# Altium project Mainboard1.PrjPcb
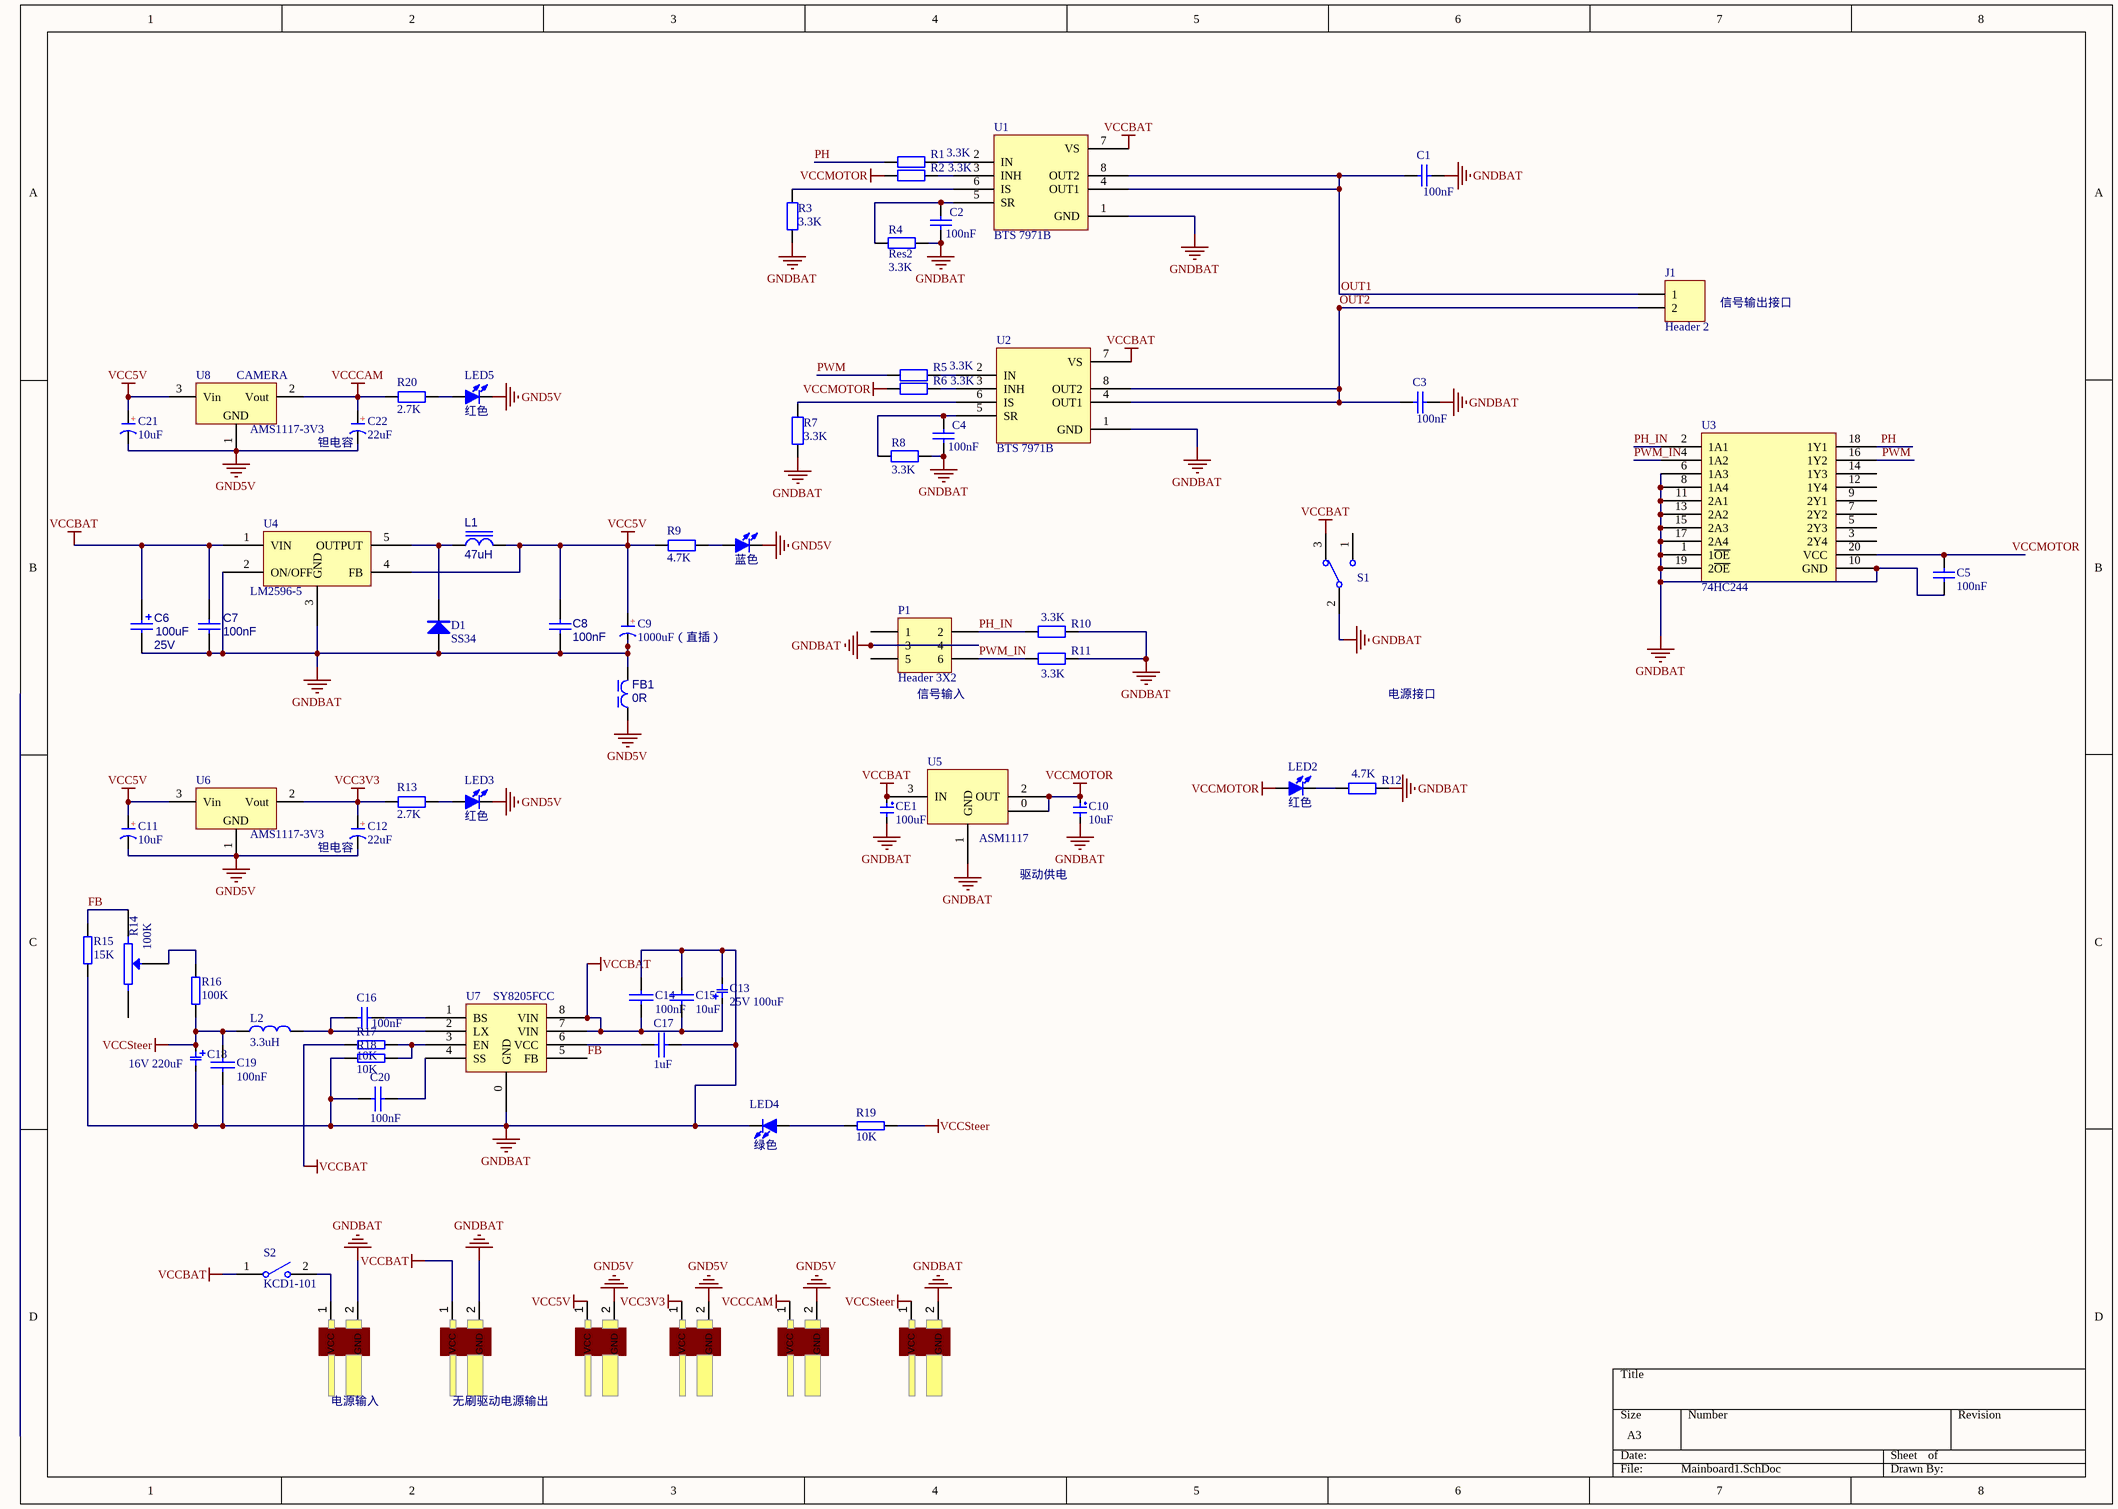
[diagram p0: Mainboard1.SchDoc]
1 sheet, 70 parts. Net scope: global (net labels, ports and power ports of the same name join across sheets).
Board files: Mainboard1.PcbDoc, logo.PcbDoc

## Sheet Mainboard1.SchDoc
size A3; DocumentNumber: 1; SheetNumber: 1; SheetTotal: 1

### Parts
C1  value 100nF  [0805]  (hidden comment: Cap)
C2  value 100nF  [0805]  (hidden comment: Cap Semi)
C3  value 100nF  [0805]  (hidden comment: Cap)
C4  value 100nF  [0805]  (hidden comment: Cap Semi)
C5  value 100nF  [0805]  (hidden comment: Cap)
C6  value 100uF  Voltage: 25V  [CAPS6.3]  (hidden comment: 100uF 25V)
C7  value 100nF  [CAPC1608[0603]S-N]  (hidden comment: 100nF ±10% 50V)
C8  value 100nF  [CAPC1608[0603]S-N]  (hidden comment: 100nF ±10% 50V)
C9  1000uF（直插）  [CAP 5.0*10*16]
C10  10uF  [CAP 5.0*10*16]
C11  10uF  [C 0805_L]
C12  22uF  [CD A(3216)]
C13  25V 100uF  [电解电容16v 220uf]
C14  100nF  [C0603]
C15  10uF  [C0603]
C16  100nF  [C0603]
C17  1uF  [C0603]
C18  16V 220uF  [电解电容16v 220uf]
C19  100nF  [C0603]
C20  100nF  [C0603]
C21  10uF  [C 0805_L]
C22  22uF  [CD A(3216)]
CE1  100uF  [CAP 5.0*10*20]
D1  SS34  [SMA[DO-214AC]]
DCIN1  T型插头  [Wired T-Header ThroughHole]  (value not drawn)
DCIN2  T型插头  [Wired T-Header ThroughHole]  (value not drawn)
DCIN3  T型插头  [Wired T-Header ThroughHole]  (value not drawn)
DCIN4  T型插头  [Wired T-Header ThroughHole]  (value not drawn)
DCIN5  T型插头  [Wired T-Header ThroughHole]  (value not drawn)
DCIN?  T型插头  [Wired T-Header ThroughHole]  (value not drawn)
FB1  0R  [INDC2012[0805]S]
J1  Header 2  [KF/WJ/DG 301-2p-5.0mm]
L1  47uH  [0630 TPC 7*7*3]
L2  3.3uH  [贴片电感7*7]
LED1  蓝色  [LED0805]
LED2  红色  [LED0805]
LED3  红色  [LED0805]
LED4  绿色  [LED0805]
LED5  红色  [LED0805]
P1  Header 3X2  [HDR2X3]
R1  value 3.3K  [0805]  (hidden comment: Res2)
R2  value 3.3K  [0805]  (hidden comment: Res2)
R3  value 3.3K  [0805]  (hidden comment: Res2)
R4  Res2  value 3.3K  [0805]
R5  value 3.3K  [0805]  (hidden comment: Res2)
R6  value 3.3K  [0805]  (hidden comment: Res2)
R7  value 3.3K  [0805]  (hidden comment: Res2)
R8  value 3.3K  [0805]
R9  4.7K  [0805]
R10  value 3.3K  [0805]  (hidden comment: Res2)
R11  value 3.3K  [0805]  (hidden comment: Res2)
R12  value 4.7K  [0805]  (hidden comment: Res2)
R13  2.7K  [0805]
R14  100K  [电位器]
R15  15K  [R0603]
R16  100K  [R0603]
R17  10K  [R0603]
R18  10K  [R0603]
R19  10K  [R0603]
R20  2.7K  [0805]
S1  SW-SPDT  [SS12D10]  (value not drawn)
S2  KCD1-101  [KCD1-101]
U1  BTS 7971B  [bts7960]
U2  BTS 7971B  [bts7960]
U3  74HC244  [SOJ-20]
U4  LM2596-5  [TO263-5A]
U5  ASM1117  [SOT223_M]
U6  AMS1117-3V3  [SOT223_M]
U7  SY8205FCC  [SOP-8E]
U8  AMS1117-3V3  [SOT223_M]

### Nets
GND5V: C11.2(K) C12.2(K) C21.2(K) C22.2(K) DCIN3.2(GND) DCIN4.2(GND) DCIN5.2(GND) FB1.1 LED1.2(K) LED3.2(K) LED5.2(K) U6.1(GND) U8.1(GND)
GNDBAT: C1.2 C2.1 C3.2 C4.1 C5.2 C6.2 C7.1 C8.1 C9.2(K) C10.2 C13.2 C14.1 C15.1 C17.2 C18.2 C19.2 C20.1 CE1.2 D1.1(A) DCIN1.2(GND) DCIN2.2(GND) DCIN?.2(GND) FB1.2 LED4.2(K) P1.3 P1.4 R3.2 R4.2 R7.2 R8.2 R10.2 R11.2 R12.2 R15.2 R18.2 S1.2 U1.1(GND) U2.1(GND) U3.1(1~{OE}) U3.6(1A3) U3.8(1A4) U3.10(GND) U3.11(2A1) U3.13(2A2) U3.15(2A3) U3.17(2A4) U3.19(2~{OE}) U4.2(ON/OFF) U4.3(GND) U5.1(GND) U7.0(GND)
VCC3V3: C12.1(A) DCIN4.1(VCC) R13.2 U6.2(Vout)
VCC5V: C8.2 C9.1(A) C11.1(A) C21.1(A) DCIN3.1(VCC) L1.2 R9.2 U4.4(FB) U6.3(Vin) U8.3(Vin)
VCCBAT: C6.1 C7.2 C13.1 C14.2 C15.2 CE1.1 DCIN2.1(VCC) R17.2 S1.3 S2.1 U1.7(VS) U2.7(VS) U4.1(VIN) U5.3(IN) U7.7(VIN) U7.8(VIN)
VCCCAM: C22.1(A) DCIN5.1(VCC) R20.2 U8.2(Vout)
VCCMOTOR: C5.1 C10.1 LED2.1(A) R2.2 R6.2 U3.20(VCC) U5.0 U5.2(OUT)
VCCSteer: C18.1 C19.1 DCIN?.1(VCC) L2.2 R16.2 R19.1
FB: R14.1 R15.1 U7.5(FB)
OUT1: C1.1 J1.1 U1.4(OUT1) U1.8(OUT2)
OUT2: C3.1 J1.2 U2.4(OUT1) U2.8(OUT2)
PH: R1.1 U3.18(1Y1)
PH_IN: P1.2 R10.1 U3.2(1A1)
PWM: R5.1 U3.16(1Y2)
PWM_IN: P1.6 R11.1 U3.4(1A2)
NetC2_2: C2.2 R4.1 U1.5(SR)
NetC4_2: C4.2 R8.1 U2.5(SR)
NetC16_1: C16.1 L2.1 U7.2(LX)
NetC16_2: C16.2 U7.1(BS)
NetC17_1: C17.1 U7.6(VCC)
NetC20_2: C20.2 U7.4(SS)
NetD1_2: D1.2(K) L1.1 U4.5(OUTPUT)
NetDCIN1_1: DCIN1.1(VCC) S2.2
NetLED1_1: LED1.1(A) R9.1
NetLED2_2: LED2.2(K) R12.1
NetLED3_1: LED3.1(A) R13.1
NetLED4_1: LED4.1(A) R19.2
NetLED5_1: LED5.1(A) R20.1
NetR1_2: R1.2 U1.2(IN)
NetR2_1: R2.1 U1.3(INH)
NetR3_1: R3.1 U1.6(IS)
NetR5_2: R5.2 U2.2(IN)
NetR6_1: R6.1 U2.3(INH)
NetR7_1: R7.1 U2.6(IS)
NetR14_3: R14.3(W) R16.1
NetR17_1: R17.1 R18.1 U7.3(EN)

Not connected (* = marked no-connect by the designer): P1 1 5; R14 2; S1 1; U3 3(2Y4) 5(2Y3) 7(2Y2) 9(2Y1) 12(1Y4) 14(1Y3)

### Notes on the sheet
- 信号输出接口
- (near U8) CAMERA
- (near C22) 钽电容
- (near P1) 信号输入
- 电源接口
- (near C12) 钽电容
- 驱动供电
- 电源输入
- 无刷驱动电源输出
- (in symbol C-CAP) +
- (in symbol C-CD) +
- (in symbol C-CM) +

### Library data of the parts
C1 C3 C5 = Cap: Capacitor; Published: 8-Jun-2000; LatestRevisionDate: 17-Jul-2002; LatestRevisionNote: Re-released for DXP Platform.; PackageReference: RAD-0.3; Publisher: Altium Limited
C2 C4 = Cap Semi: Capacitor (Semiconductor SIM Model); Published: 8-Jun-2000; LatestRevisionDate: 17-Jul-2002; LatestRevisionNote: Re-released for DXP Platform.; PackageReference: C1206; Publisher: Altium Limited
C6 = Cap-Solid: Polarized Capacitor (Radial); Published: 8-Jun-2000; Revision: July-2002: Re-released for DXP Platform.; Publisher: Altium Limited; Price(RMB): 0.000
C7 C8 = Cap-Chip: 贴片电容; Published: 8-Jun-2000; Revision: July-2002: Re-released for DXP Platform.; Publisher: Altium Limited; Price(RMB): 0.000; Voltage: 50V; Tolerance: ±10%
C9 = C-CAP: 直插电解电容; 版权归属: 源创客; BOM名称: 直插电解电容; 学习资源: www.ooocke.com
C10 CE1 = CAP1
C11 C21 = C-CM: 贴片电解电容; 版权归属: 源创客; BOM名称: 贴片电解电容; 学习资源: www.ooocke.com
C12 C22 = C-CD: 贴片钽电容; 版权归属: 源创客; BOM名称: 贴片钽电容; 学习资源: www.ooocke.com
C13 C18 = ECAP
C14 C15 C17 C19 C20 = 普通电容: Capacitor
C16 = C_0603
D1 = 1N5819: 肖特基二极管; 版权归属: 源创客; 属性: 40V/2A; BOM名称: 肖特基二极管; 学习资源: www.ooocke.com
DCIN1-DCIN5 DCIN? = T_Header
FB1 = Ind-Chip: Chip Inductor, Ferrite-Core, Silkscreen Border; Imax: 50mA; DCR: .1m; Published: 8-Jun-2000; Revision: July-2002: Re-released for DXP Platform.; Publisher: Altium Limited; Price(RMB): 0.000; Value: 0R
J1 = Header 2: Header, 2-Pin; LatestRevisionDate: 17-Jul-2002; LatestRevisionNote: Re-released for DXP Platform.; Publisher: Altium Limited
L1 = Ind Power: Power Inductor, Ferrite-Core; Imax: 50mA; DCR: .5m; Published: 8-Jun-2000; Revision: July-2002: Re-released for DXP Platform.; Publisher: Altium Limited; Price(RMB): 0.000; Value: 47uH
L2 = L1
LED1 LED3 LED5 = LED-SMD: 贴片LED; 版权归属: 黎明电子style; BOM名称: 贴片LED; 学习资源: https://lmdzstyle.taobao.com/
LED2 = LED-SMD: 贴片LED; 版权归属: 源创客; BOM名称: 贴片LED; 学习资源: www.ooocke.com
LED4 = LED-3MM: 插件LED; 版权归属: 源创客; BOM名称: 插件LED; 学习资源: www.ooocke.com
P1 = Header 3X2: Header, 3-Pin, Dual row; LatestRevisionDate: 17-Jul-2002; LatestRevisionNote: Re-released for DXP Platform.; Publisher: Altium Limited
R1-R8 R10-R12 = Res2: Resistor; Published: 8-Jun-2000; LatestRevisionDate: 17-Jul-2002; LatestRevisionNote: Re-released for DXP Platform.; PackageReference: AXIAL-0.4; Publisher: Altium Limited
  R4 R8: PackageDescription: Axial Device, Thru-Hole; 2 Leads; 0.4 in Pin Spacing
R9 R13 R20 = R: 贴片电阻; 版权归属: 黎明电子style; BOM名称: 贴片电阻; 学习资源: https://lmdzstyle.taobao.com/
R14 = RESVR: Potentiometer
R15-R19 = R_0603
S1 = SW-SPDT: 单刀双掷开关 3脚船型、钮子、拨动开关 SPDT Subminiature Toggle Switch; Published: 24-Mar-1999; Publisher: Altium Limited; Price(RMB): 0.000
S2 = KCD1-101: 1路单刀船型开关; 版权归属: 源创客; BOM名称: 1路单刀船型开关; 学习资源: www.ooocke.com
U1 U2 = BTS 7960B
U3 = 7
U6 U8 = AMS1117: 三端稳压芯片; BOM名称: 稳压芯片; 版权归属: 源创客; 学习资源: www.ooocke.com